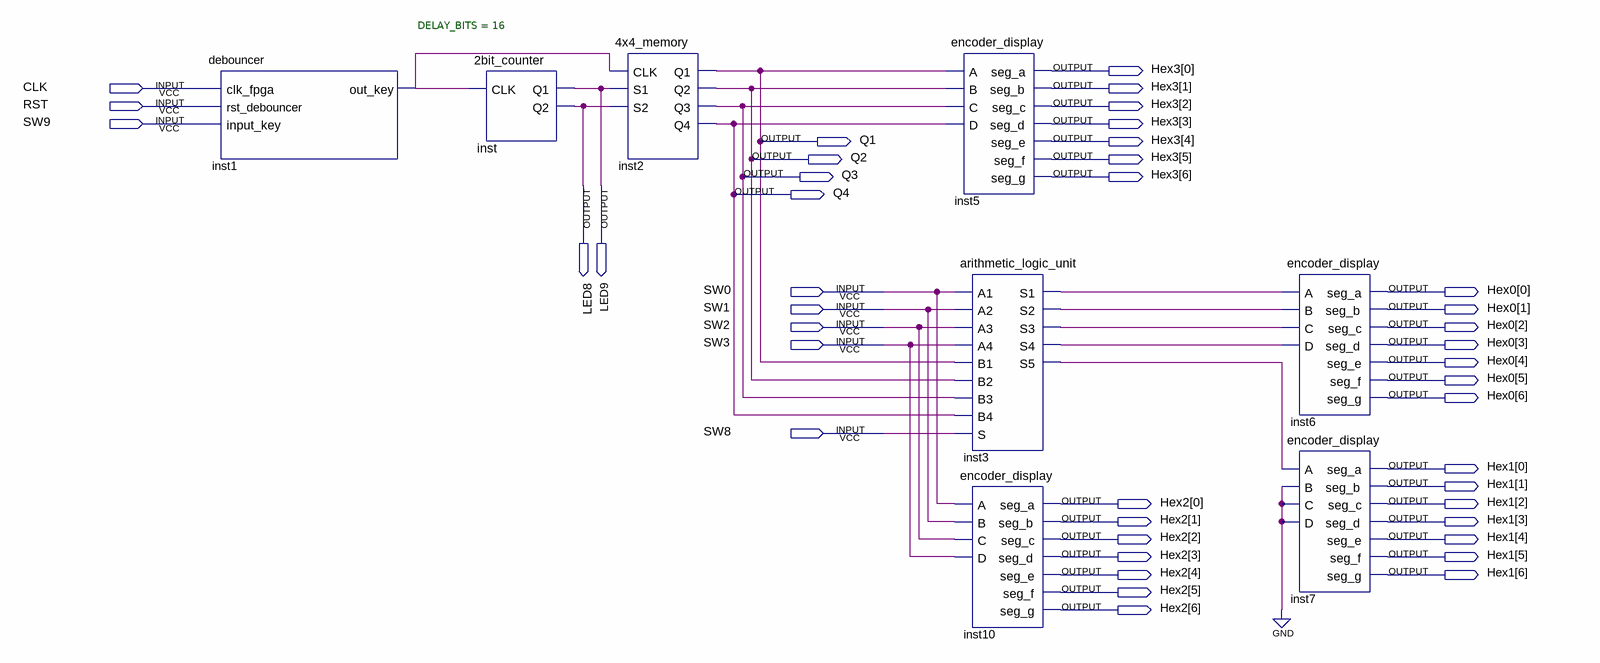
[diagram p0: schematic sheet]
// Quartus schematic CPU.bdf as structural Verilog: 8 symbols, 42 pins
module CPU (
  input  CLK,
  input  RST,
  input  SW9,
  input  SW0,
  input  SW1,
  input  SW2,
  input  SW3,
  input  SW8,
  output [6:0] Hex3,
  output Q1,
  output Q2,
  output Q3,
  output LED8,
  output LED9,
  output Q4,
  output [6:0] Hex0,
  output [6:0] Hex1,
  output [6:0] Hex2
);

  wire inst1_out_key, inst3_s1, inst3_s2, inst3_s3, inst3_s4, inst3_s5;

  debouncer #(.DELAY_BITS(16)) inst1 (.clk_fpga(CLK), .rst_debouncer(RST), .input_key(SW9), .out_key(inst1_out_key));
  \2bit_counter  inst (.CLK(inst1_out_key), .Q1(LED9), .Q2(LED8));
  \4x4_memory  inst2 (.CLK(inst1_out_key), .S1(LED9), .S2(LED8), .Q1(Q1), .Q2(Q2), .Q3(Q3), .Q4(Q4));
  encoder_display inst5 (
    .A(Q1), .B(Q2), .C(Q3), .D(Q4), .seg_a(Hex3[0]), .seg_b(Hex3[1]), .seg_c(Hex3[2]), .seg_d(Hex3[3]),
    .seg_e(Hex3[4]), .seg_f(Hex3[5]), .seg_g(Hex3[6]));
  arithmetic_logic_unit inst3 (
    .A1(SW0), .A2(SW1), .A3(SW2), .A4(SW3), .B1(Q1), .B2(Q2), .B3(Q3), .B4(Q4), .S(SW8), .S1(inst3_s1),
    .S2(inst3_s2), .S3(inst3_s3), .S4(inst3_s4), .S5(inst3_s5));
  encoder_display inst10 (
    .A(SW0), .B(SW1), .C(SW2), .D(SW3), .seg_a(Hex2[0]), .seg_b(Hex2[1]), .seg_c(Hex2[2]), .seg_d(Hex2[3]),
    .seg_e(Hex2[4]), .seg_f(Hex2[5]), .seg_g(Hex2[6]));
  encoder_display inst6 (
    .A(inst3_s1), .B(inst3_s2), .C(inst3_s3), .D(inst3_s4), .seg_a(Hex0[0]), .seg_b(Hex0[1]),
    .seg_c(Hex0[2]), .seg_d(Hex0[3]), .seg_e(Hex0[4]), .seg_f(Hex0[5]), .seg_g(Hex0[6]));
  encoder_display inst7 (
    .A(inst3_s5), .B(1'b0), .C(1'b0), .D(1'b0), .seg_a(Hex1[0]), .seg_b(Hex1[1]), .seg_c(Hex1[2]),
    .seg_d(Hex1[3]), .seg_e(Hex1[4]), .seg_f(Hex1[5]), .seg_g(Hex1[6]));
endmodule
